# Altium schematic sheet [04] - DW radio.SchDoc: DWM1003
size A4; DocumentNumber: 4; Revision: v2; SheetNumber: 4; SheetTotal: 7; SheetFunction: DW1000
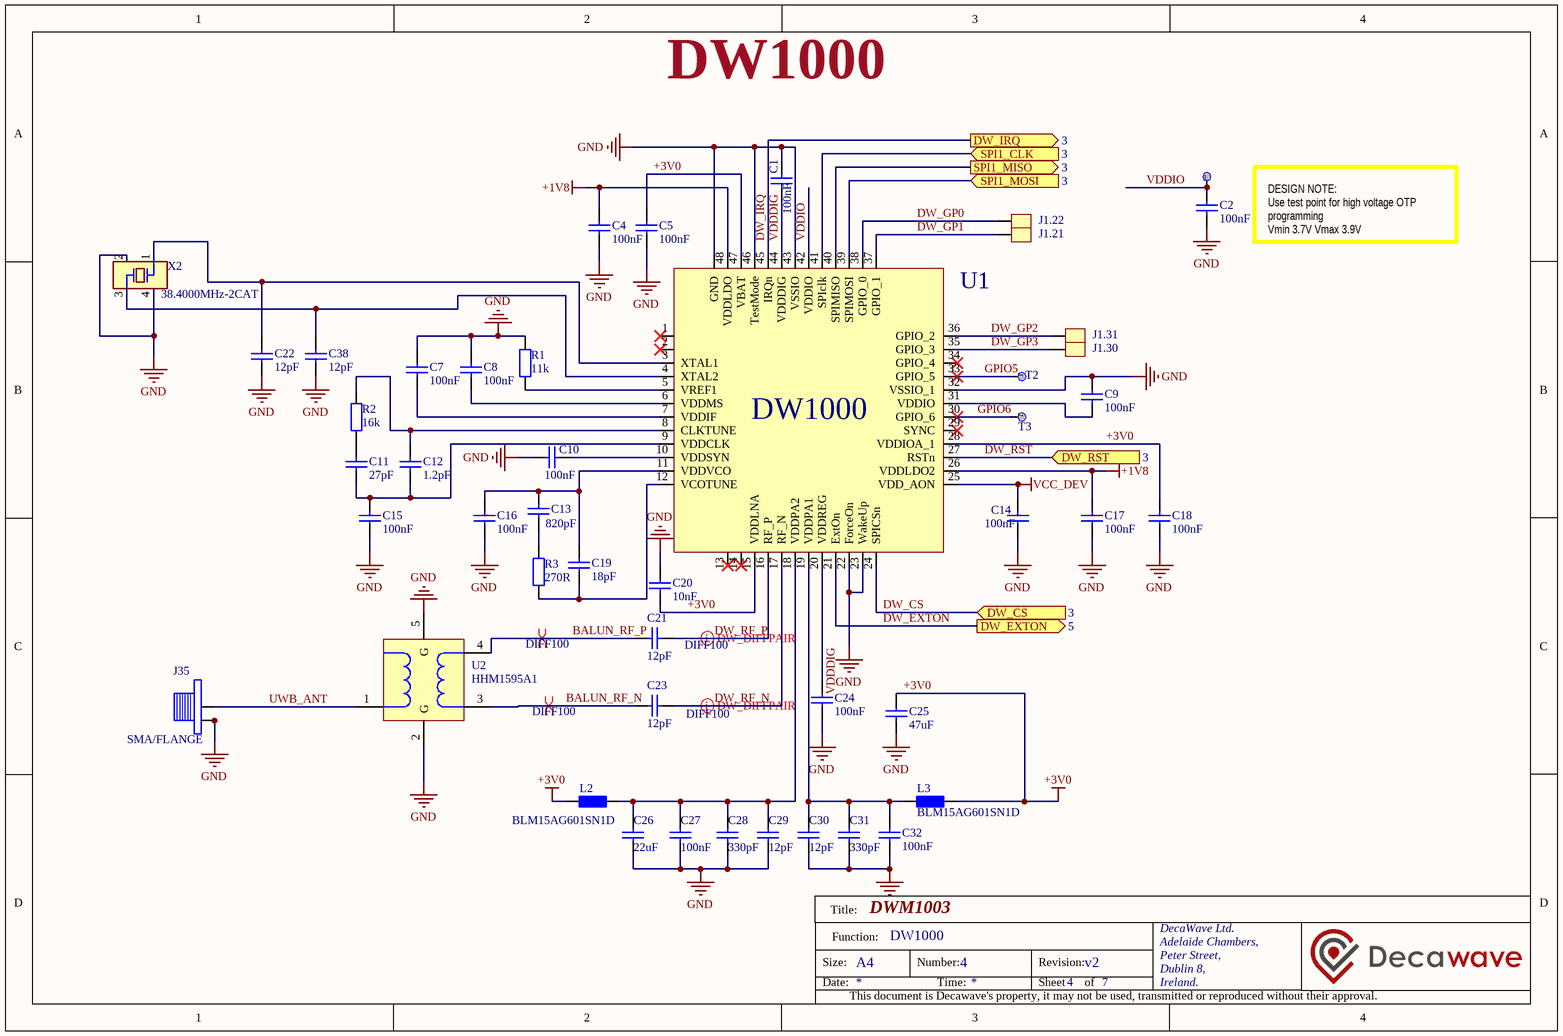
[diagram p0: [04] - DW radio.SchDoc]

## Parts
C1  100nF  [C0201]
C2  100nF  [C0201]
C4  100nF  [C0201]
C5  100nF  [C0201]
C7  100nF  [C0201]
C8  100nF  [C0201]
C9  100nF  [C0201]
C10  100nF  [C0201]
C11  27pF  [C0201]
C12  1.2pF  [C0201]
C13  820pF  [C0201]
C14  100nF  [C0201]
C15  100nF  [C0201]
C16  100nF  [C0201]
C17  100nF  [C0201]
C18  100nF  [C0201]
C19  18pF  [C0201]
C20  10nF  [C0201]
C21  12pF  [C0201]
C22  12pF  [C0201]
C23  12pF  [C0201]
C24  100nF  [C0201]
C25  47uF  [C0805]
C26  22uF  [C0805]
C27  100nF  [C0201]
C28  330pF  [C0201]
C29  12pF  [C0201]
C30  12pF  [C0201]
C31  330pF  [C0201]
C32  100nF  [C0201]
C38  12pF  [C0201]
J1.21  EDGE_PIN  [PCB_EDGE_1MM]  (value not drawn)  (no BOM)
J1.22  EDGE_PIN  [PCB_EDGE_1MM]  (value not drawn)  (no BOM)
J1.30  EDGE_PIN  [PCB_EDGE_1MM]  (value not drawn)  (no BOM)
J1.31  EDGE_PIN  [PCB_EDGE_1MM]  (value not drawn)  (no BOM)
J35  SMA/FLANGE  [SMA_KHD3800]
L2  BLM15AG601SN1D  [INDC1005X05N]
L3  BLM15AG601SN1D  [INDC1005X05N]
R1  11k  [R0201]
R2  16k  [R0201]
R3  270R  [R0201]
T1  TestPAD  [Testpad]  (value not drawn)
T2  TestPAD  [Testpad]  (value not drawn)
T3  TestPAD  [Testpad]  (value not drawn)
U1  DW1000 IC  [QFN-48_DW1000]  (value not drawn)
U2  HHM1595A1  [BALUN_HHM1595A1]
X2  38.4000MHz-2CAT  [ABM10]

## Ports
DW_CS (in, see 3), DW_EXTON (out, see 5), DW_IRQ (out, see 3), DW_RST (in, see 3), SPI1_CLK (in, see 3), SPI1_MISO (out, see 3), SPI1_MOSI (in, see 3)

## Nets
+1V8: C4.2 C17.2 U1.26(VDDLDO2) U1.48(VDDLDO)
+3V0: C5.2 C18.2 C20.1 C25.2 L2.1 L3.2 U1.15(VDDLNA) U1.28(VDDIOA_1) U1.47(VBAT)
GND: C1.1 C2.1 C4.1 C5.1 C7.2 C8.2 C9.2 C10.2 C14.1 C15.1 C16.1 C17.1 C18.1 C20.2 C22.1 C24.1 C25.1 C26.1 C27.1 C28.1 C29.1 C30.1 C31.1 C32.1 C38.1 J35.2 J35.3 J35.4 J35.5 R1.2 U1.22(ForceOn) U1.23(WakeUp) U1.32(VSSIO_1) U1.43(VSSIO) U1.46(TestMode) U1.EP(GND) U2.2(G) U2.5(G) X2.2 X2.4
VCC_DEV: C14.2 U1.25(VDD_AON)
BALUN_RF_N: C23.1 U2.3(B)
BALUN_RF_P: C21.1 U2.4(B)
DW_CS: U1.24(SPICSn) ; port DW_CS
DW_EXTON: U1.21(ExtOn) ; port DW_EXTON
DW_GP0: J1.22.0 U1.38(GPIO_0)
DW_GP1: J1.21.0 U1.37(GPIO_1)
DW_GP2: J1.31.0 U1.36(GPIO_2)
DW_GP3: J1.30.0 U1.35(GPIO_3)
DW_IRQ: U1.45(IRQn) ; port DW_IRQ
DW_RF_N: C23.2 U1.17(RF_N)
DW_RF_P: C21.2 U1.16(RF_P)
DW_RST: U1.27(RSTn) ; port DW_RST
GPIO5: T2.1 U1.33(GPIO_5)
GPIO6: T3.1 U1.30(GPIO_6)
SPI1_CLK: U1.41(SPIclk) ; port SPI1_CLK
SPI1_MISO: U1.40(SPIMISO) ; port SPI1_MISO
SPI1_MOSI: U1.39(SPIMOSI) ; port SPI1_MOSI
UWB_ANT: J35.1 U2.1(UB)
VDDDIG: C1.2 C24.2 U1.20(VDDREG) U1.44(VDDDIG)
VDDIO: C2.2 T1.1 U1.42(VDDIO)
NetC7_1: C7.1 U1.7(VDDIF)
NetC8_1: C8.1 U1.6(VDDMS)
NetC9_1: C9.1 U1.31(VDDIO)
NetC10_1: C10.1 U1.10(VDDSYN)
NetC11_1: C11.1 C12.1 C15.2 U1.9(VDDCLK)
NetC11_2: C11.2 R2.1
NetC12_2: C12.2 R2.2 U1.8(CLKTUNE)
NetC13_1: C13.1 R3.2
NetC13_2: C13.2 C16.2 C19.2 U1.11(VDDVCO)
NetC19_1: C19.1 R3.1 U1.12(VCOTUNE)
NetC22_2: C22.2 U1.3(XTAL1) X2.1
NetC26_2: C26.2 C27.2 C28.2 C29.2 L2.2 U1.18(VDDPA2)
NetC30_2: C30.2 C31.2 C32.2 L3.1 U1.19(VDDPA1)
NetC38_2: C38.2 U1.4(XTAL2) X2.3
NetR1_1: R1.1 U1.5(VREF1)

Not connected (* = marked no-connect by the designer): U1 1* 2* 13* 14* 29(SYNC)* 34(GPIO_4)*

## Layout directives
differential pair; net class DIFF100: DW_RF_N, DW_RF_P
differential pair; Class: DIFF100: BALUN_RF_N, BALUN_RF_P

## Notes on the sheet
- DW1000
- DESIGN NOTE:
  Use test point for high voltage OTP programming
  Vmin 3.7V Vmax 3.9V
- Title:
- Size:
- Date:
- Function:
- A4
- Number:
- Time:
- Revision:
- Sheet
- of
- DecaWave Ltd.
- Adelaide Chambers,
- Peter Street,
- Dublin 8,
- Ireland.
- This document is Decawave's property, it may not be used, transmitted or reproduced without their approval.
- (in symbol TestPAD) T

## Library data of the parts
C1 C2 C4 C5 C7-C10 C14-C18 C24 C27 C32 = GRM033C81E104ME14D: CAP CER 0.1UF 25V X6S 0201; Manufacturer: Murata Electronics North America; Manufacturer Part Number: GRM033C81E104ME14D
C11 = GRM0335C1E270JA01D: CAP CER 27PF 25V NP0 0201; Manufacturer: Murata Electronics North America; Manufacturer Part Number: GRM0335C1E270JA01D
C12 = GRM0335C1E1R2CA01D: CAP CER 1.2PF 25V NP0 0201; Manufacturer: Murata Electronics North America; Manufacturer Part Number: GRM0335C1E1R2CA01D
C13 = GRM033R71E821KA01D: CAP CER 820PF 25V X7R 0201; Manufacturer: Murata Electronics North America; Manufacturer Part Number: GRM033R71E821KA01D
C19 = GRM0335C1H180JA01D: CAP CER 18PF 50V NP0 0201; Manufacturer: Murata Electronics North America; Manufacturer Part Number: GRM0335C1H180JA01D; Thickness (Max): *
C20 = GRM033R61E103KA12D: CAP CER 10000PF 25V X5R 0201; Manufacturer: Murata Electronics North America; Manufacturer Part Number: GRM033R61E103KA12D
C21-C23 C29 C30 C38 = GRM0335C1E120JA01D: CAP CER 12PF 25V NP0 0201; Manufacturer: Murata Electronics North America; Manufacturer Part Number: GRM0335C1E120JA01D
C25 = GRM21BR60J226ME39L: CAP CER 47UF 6.3V X5R 0603; Manufacturer: Murata Electronics North America; Manufacturer Part Number: GRM188R60J476ME15D
C26 = GRM21BR60J226ME39L: CAP CER 22UF 6.3V X5R 0805; Manufacturer: Samsung; Manufacturer Part Number: CL21A226MQQNNNE
C28 C31 = GRM033R71E331KA01D: CAP CER 330PF 25V X7R 0201; Manufacturer: Samsung; Manufacturer Part Number: CL03B331KA3NNNC
J1.21 J1.22 J1.30 J1.31 = EDGE_PIN: PCB Edge pin
J35 = SMA/FLANGE: SMA FLANGE JACK
L2 L3 = BLM15AG601SN1D: FERRITE BEAD 600 OHM 0402 1LN; Manufacturer: Murata Electronics North America; Manufacturer Part Number: BLM15AG601SN1D
R1 = RC0201FR-0711KL: RES SMD 11K OHM 1% 1/20W 0201; Manufacturer: Yageo; Manufacturer Part Number: RC0201FR-0711KL
R2 = RC0201FR-0716KL: RES SMD 16K OHM 1% 1/20W 0201; Manufacturer: Yageo; Manufacturer Part Number: RC0201FR-0716KL
R3 = RC0201FR-07270RL: RES SMD 270 OHM 1% 1/20W 0201; Manufacturer: Yageo; Manufacturer Part Number: RC0201FR-07270RL
U1 = DW1000_QFN_48: UWB DW1000 QFN48; Manufacturer: Decawave Ltd.; Cost: *; Footprint: QFN_48; Manufacturer Part Number: DW1000
U2 = IND_BALUN_HHM1595A1: Mulitilayer Balun; Manufacturer: TDK; Manufacturer Part Number: HHM1595A1
X2 = ABM10: Manufacturer: Commutek; Manufacturer Part Number: 2CAT